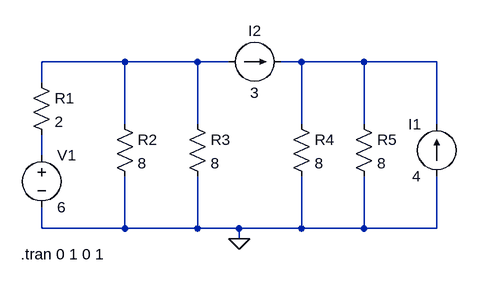
[diagram p0: schematic Circuit_6.asc]
Circuit_6.asc, the LTspice schematic file:
Version 4.1
SHEET 1 880 680
WIRE 128 48 0 48
WIRE 240 48 128 48
WIRE 288 48 240 48
WIRE 400 48 368 48
WIRE 496 48 400 48
WIRE 608 48 496 48
WIRE 0 80 0 48
WIRE 128 144 128 48
WIRE 240 144 240 48
WIRE 400 144 400 48
WIRE 496 144 496 48
WIRE 608 144 608 48
WIRE 0 192 0 160
WIRE 0 304 0 272
WIRE 128 304 128 224
WIRE 128 304 0 304
WIRE 240 304 240 224
WIRE 240 304 128 304
WIRE 304 304 240 304
WIRE 400 304 400 224
WIRE 400 304 304 304
WIRE 496 304 496 224
WIRE 496 304 400 304
WIRE 608 304 608 224
WIRE 608 304 496 304
WIRE 304 320 304 304
FLAG 304 320 0
SYMBOL voltage 0 176 R0
WINDOW 123 0 0 Left 0
WINDOW 39 0 0 Left 0
SYMATTR InstName V1
SYMATTR Value 6
SYMBOL res -16 64 R0
SYMATTR InstName R1
SYMATTR Value 2
SYMBOL res 112 128 R0
SYMATTR InstName R2
SYMATTR Value 8
SYMBOL res 224 128 R0
SYMATTR InstName R3
SYMATTR Value 8
SYMBOL res 384 128 R0
SYMATTR InstName R4
SYMATTR Value 8
SYMBOL res 480 128 R0
SYMATTR InstName R5
SYMATTR Value 8
SYMBOL current 608 224 R180
WINDOW 0 24 80 Left 2
WINDOW 3 24 0 Left 2
WINDOW 123 0 0 Left 0
WINDOW 39 0 0 Left 0
SYMATTR InstName I1
SYMATTR Value 4
SYMBOL current 288 48 R270
WINDOW 0 32 40 VTop 2
WINDOW 3 -32 40 VBottom 2
WINDOW 123 0 0 Left 0
WINDOW 39 0 0 Left 0
SYMATTR InstName I2
SYMATTR Value 3
TEXT -32 344 Left 2 !.tran 0 1 0 1

The netlist it stands for:
* Circuit_6.asc
V1 N003 0 6
R1 N001 N003 2
R2 N001 0 8
R3 N001 0 8
R4 N002 0 8
R5 N002 0 8
I1 0 N002 4
I2 N001 N002 3
.tran 0 1 0 1
.backanno
.end